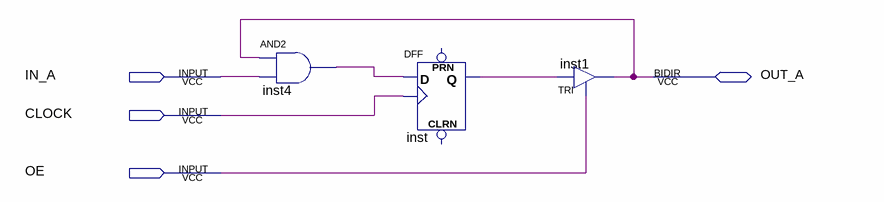
[diagram p0: schematic sheet]
// Quartus schematic PROVA.bdf as structural Verilog: 3 symbols, 4 pins
module PROVA (
  input  IN_A,
  input  CLOCK,
  input  OE,
  inout  OUT_A
);

  wire inst4_out, inst_q;

  and inst4 (inst4_out, OUT_A, IN_A);
  DFF inst (.CLK(CLOCK), .D(inst4_out), .Q(inst_q));  // open: CLRN, PRN
  TRI inst1 (.IN(inst_q), .OE(OE), .OUT(OUT_A));
endmodule
